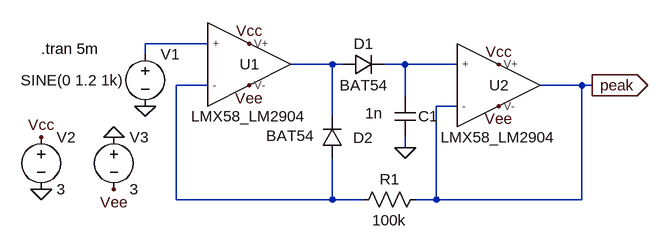
[diagram p0: schematic detector.asc]
detector.asc, the LTspice schematic file:
Version 4.1
SHEET 1 880 680
WIRE 96 128 0 128
WIRE 0 144 0 128
WIRE 288 160 224 160
WIRE 304 160 288 160
WIRE 400 160 368 160
WIRE 480 160 400 160
WIRE 96 192 48 192
WIRE 672 192 608 192
WIRE 688 192 672 192
WIRE 400 208 400 160
WIRE 480 224 448 224
WIRE 288 240 288 160
WIRE 400 288 400 272
WIRE 48 368 48 192
WIRE 288 368 288 304
WIRE 288 368 48 368
WIRE 336 368 288 368
WIRE 448 368 448 224
WIRE 448 368 416 368
WIRE 672 368 672 192
WIRE 672 368 448 368
FLAG 400 288 0
FLAG 0 224 0
FLAG -48 272 0
FLAG -160 352 0
FLAG -160 272 Vcc
FLAG 160 128 Vcc
FLAG 544 160 Vcc
FLAG -48 352 Vee
FLAG 160 192 Vee
FLAG 544 224 Vee
FLAG 688 192 peak
IOPIN 688 192 Out
SYMBOL voltage 0 128 R0
WINDOW 3 -33 56 Right 2
WINDOW 123 0 0 Left 0
WINDOW 39 0 0 Left 0
SYMATTR InstName V1
SYMATTR Value SINE(0 1.2 1k)
SYMBOL diode 304 176 R270
WINDOW 0 32 32 VTop 2
WINDOW 3 0 32 VBottom 2
SYMATTR InstName D1
SYMATTR Value BAT54
SYMATTR Description Diode
SYMATTR Type diode
SYMBOL diode 304 304 R180
WINDOW 0 -47 31 Left 2
WINDOW 3 44 34 Left 2
SYMATTR InstName D2
SYMATTR Value BAT54
SYMATTR Description Diode
SYMATTR Type diode
SYMBOL res 432 352 R90
WINDOW 0 0 56 VBottom 2
WINDOW 3 32 56 VTop 2
SYMATTR InstName R1
SYMATTR Value 100k
SYMBOL cap 384 208 R0
WINDOW 0 36 32 Left 2
WINDOW 3 -45 27 Left 2
SYMATTR InstName C1
SYMATTR Value 1n
SYMBOL voltage -160 256 R0
WINDOW 123 0 0 Left 0
WINDOW 39 0 0 Left 0
SYMATTR InstName V2
SYMATTR Value 3
SYMBOL voltage -48 256 R0
WINDOW 123 0 0 Left 0
WINDOW 39 0 0 Left 0
SYMATTR InstName V3
SYMATTR Value 3
SYMBOL LMX58_LM2904 160 160 R0
SYMATTR InstName U1
SYMBOL LMX58_LM2904 544 192 R0
SYMATTR InstName U2
TEXT -160 136 Left 2 !.tran 5m

The netlist it stands for:
* detector.asc
V1 N001 0 SINE(0 1.2 1k)
D1 N002 N003 BAT54
D2 N004 N002 BAT54
R1 peak N004 100k
C1 N003 0 1n
V2 Vcc 0 3
V3 0 Vee 3
X§U1 N001 N004 Vcc Vee N002 LMX58_LM2904  ; pins + - V+ V- OUT
X§U2 N003 peak Vcc Vee peak LMX58_LM2904  ; pins + - V+ V- OUT
.model D D
.lib standard.dio
.tran 5m
.lib LMX58_LM2904.lib
.backanno
.end